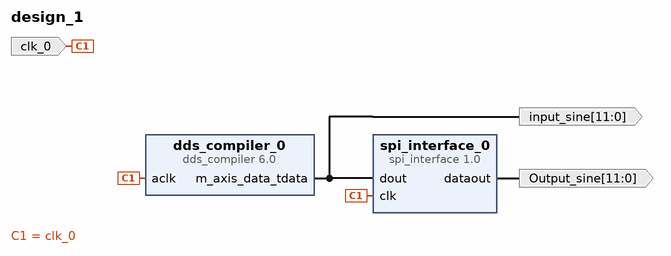
[diagram p0: block diagram of the top level]
# Vivado block design design_1, xc7a200tfbg676-2, Vivado 2018.3
create_bd_design design_1

create_bd_port -dir I -type clk clk_0
create_bd_port -dir O -from 11 -to 0 Output_sine
create_bd_port -dir O -from 11 -to 0 input_sine

create_bd_cell -type ip -vlnv xilinx.com:ip:dds_compiler:6.0 dds_compiler_0
set_property -dict [list \
  CONFIG.Amplitude_Mode Full_Range \
  CONFIG.DATA_Has_TLAST Not_Required \
  CONFIG.DDS_Clock_Rate 50 \
  CONFIG.Frequency_Resolution 0.4 \
  CONFIG.Has_Phase_Out false \
  CONFIG.Latency 3 \
  CONFIG.M_DATA_Has_TUSER Not_Required \
  CONFIG.Noise_Shaping Auto \
  CONFIG.Output_Frequency1 0.00005 \
  CONFIG.Output_Selection Sine \
  CONFIG.Output_Width 8 \
  CONFIG.PINC1 10000110 \
  CONFIG.Phase_Width 27 \
  CONFIG.Phase_offset None \
  CONFIG.S_PHASE_Has_TUSER Not_Required \
  CONFIG.Spurious_Free_Dynamic_Range 45 \
] [get_bd_cells dds_compiler_0]
create_bd_cell -type ip -vlnv xilinx.com:user:spi_interface:1.0 spi_interface_0

# ---- connections ----

connect_bd_net -net clk_0_1 [get_bd_ports clk_0] [get_bd_pins spi_interface_0/clk] [get_bd_pins dds_compiler_0/aclk]
connect_bd_net [get_bd_pins dds_compiler_0/m_axis_data_tdata] [get_bd_pins spi_interface_0/dout] [get_bd_ports input_sine]
connect_bd_net [get_bd_pins spi_interface_0/dataout] [get_bd_ports Output_sine]

validate_bd_design
save_bd_design
